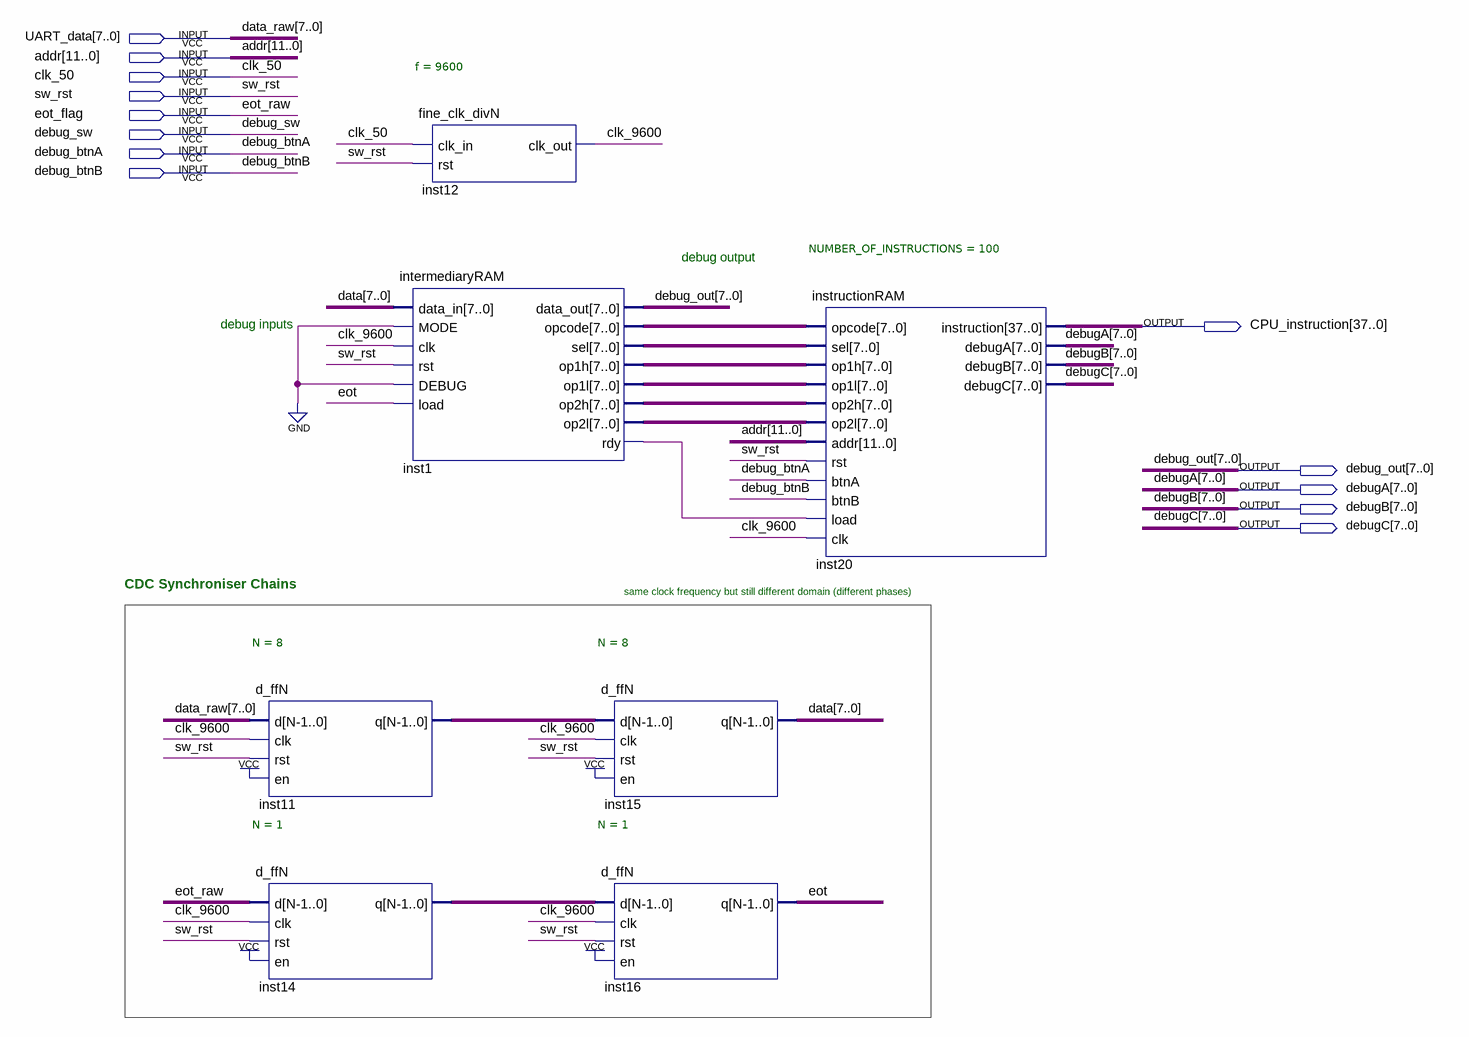
[diagram p0: schematic sheet]
// Quartus schematic InstructionBuffer.bdf as structural Verilog: 7 symbols, 13 pins
module InstructionBuffer (
  input  [7:0] UART_data,
  input  [11:0] addr,
  input  clk_50,
  input  sw_rst,
  input  eot_flag,
  input  debug_sw,
  input  debug_btnA,
  input  debug_btnB,
  output [37:0] CPU_instruction,
  output [7:0] debug_out,
  output [7:0] debugA,
  output [7:0] debugB,
  output [7:0] debugC
);

  wire clk_9600, eot, inst1_rdy, inst14_q;
  wire [7:0] data, inst1_op1h, inst1_op1l, inst1_op2h, inst1_op2l, inst1_opcode, inst1_sel, inst11_q;

  d_ffN #(.N(8)) inst11 (.d(UART_data), .clk(clk_9600), .rst(sw_rst), .en(1'b1), .q(inst11_q));
  d_ffN #(.N(1)) inst14 (.d(eot_flag), .clk(clk_9600), .rst(sw_rst), .en(1'b1), .q(inst14_q));
  fine_clk_divN #(.f(9600)) inst12 (.clk_in(clk_50), .rst(sw_rst), .clk_out(clk_9600));
  intermediaryRAM inst1 (
    .data_in(data), .MODE(1'b0), .clk(clk_9600), .rst(sw_rst), .DEBUG(1'b0), .load(eot),
    .data_out(debug_out), .opcode(inst1_opcode), .sel(inst1_sel), .op1h(inst1_op1h), .op1l(inst1_op1l),
    .op2h(inst1_op2h), .op2l(inst1_op2l), .rdy(inst1_rdy));
  d_ffN #(.N(8)) inst15 (.d(inst11_q), .clk(clk_9600), .rst(sw_rst), .en(1'b1), .q(data));
  d_ffN #(.N(1)) inst16 (.d(inst14_q), .clk(clk_9600), .rst(sw_rst), .en(1'b1), .q(eot));
  instructionRAM #(.NUMBER_OF_INSTRUCTIONS(100)) inst20 (
    .opcode(inst1_opcode), .sel(inst1_sel), .op1h(inst1_op1h), .op1l(inst1_op1l), .op2h(inst1_op2h),
    .op2l(inst1_op2l), .addr(addr), .rst(sw_rst), .btnA(debug_btnA), .btnB(debug_btnB), .load(inst1_rdy),
    .clk(clk_9600), .instruction(CPU_instruction), .debugA(debugA), .debugB(debugB), .debugC(debugC));

  // Other names for the same wires on the sheet: data_raw[7:0] = UART_data; eot_raw = eot_flag

  // Notes on the sheet:
  //   debug output
  //   debug inputs
  //   CDC Synchroniser Chains
  //   same clock frequency but still different domain (different phases)
endmodule
